# EAGLE schematic 24x16_RGB_Top (EAGLE 6.5.0)

## Sheet 1 of 2
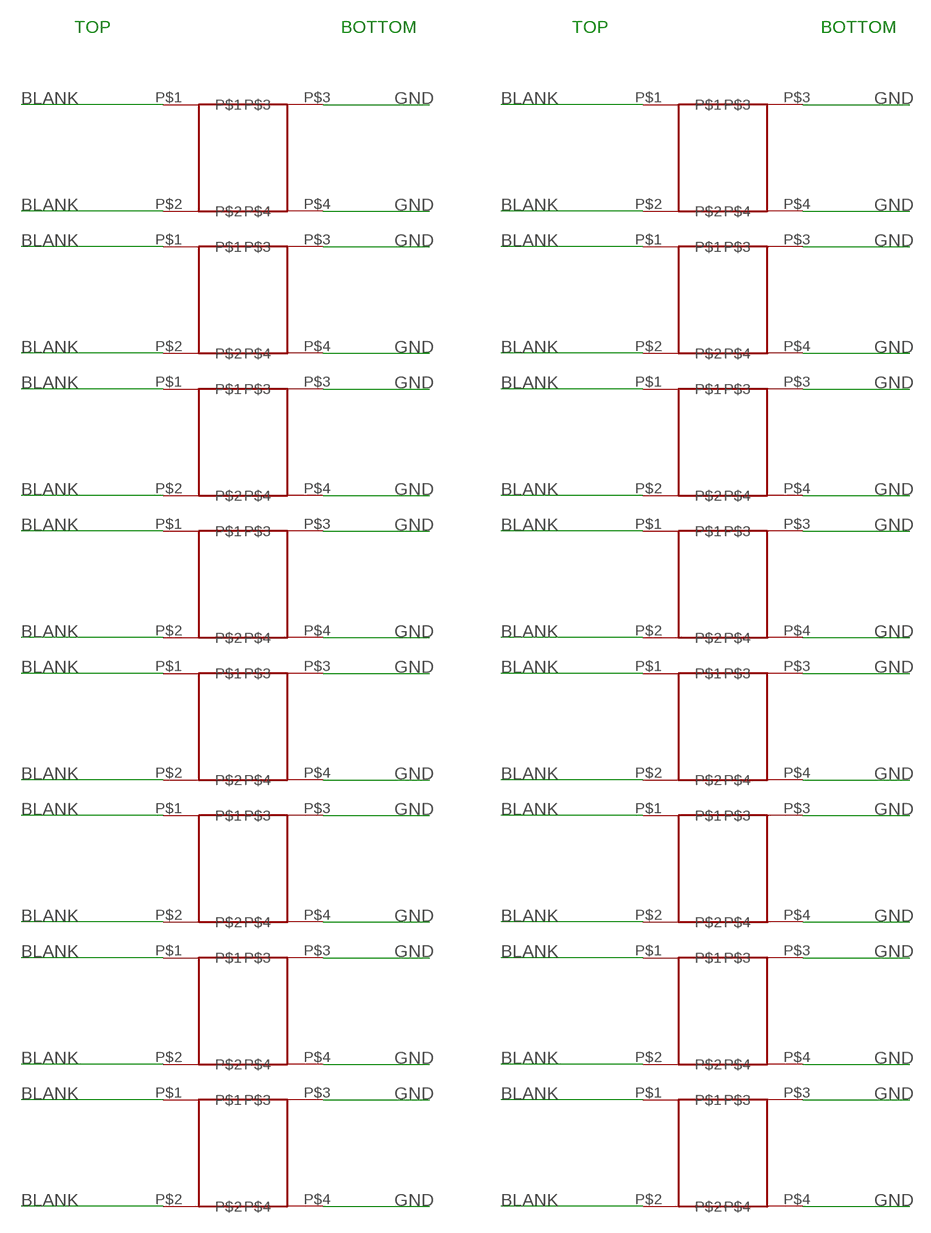
[diagram p0: schematic, sheet 1]

### Parts
SLOT1  SLOT  [SLOT]
SLOT2  SLOT  [SLOT]
SLOT3  SLOT  [SLOT]
SLOT4  SLOT  [SLOT]
SLOT5  SLOT  [SLOT]
SLOT6  SLOT  [SLOT]
SLOT7  SLOT  [SLOT]
SLOT8  SLOT  [SLOT]
SLOT9  SLOT  [SLOT]
SLOT10  SLOT  [SLOT]
SLOT11  SLOT  [SLOT]
SLOT12  SLOT  [SLOT]
SLOT13  SLOT  [SLOT]
SLOT14  SLOT  [SLOT]
SLOT15  SLOT  [SLOT]
SLOT16  SLOT  [SLOT]

### Nets
BLANK: SLOT1.P$1 SLOT1.P$2 SLOT2.P$1 SLOT2.P$2 SLOT3.P$1 SLOT3.P$2 SLOT4.P$1 SLOT4.P$2 SLOT5.P$1 SLOT5.P$2 SLOT6.P$1 SLOT6.P$2 SLOT7.P$1 SLOT7.P$2 SLOT8.P$1 SLOT8.P$2 SLOT9.P$1 SLOT9.P$2 SLOT10.P$1 SLOT10.P$2 SLOT11.P$1 SLOT11.P$2 SLOT12.P$1 SLOT12.P$2 SLOT13.P$1 SLOT13.P$2 SLOT14.P$1 SLOT14.P$2 SLOT15.P$1 SLOT15.P$2 SLOT16.P$1 SLOT16.P$2
GND: SLOT1.P$3 SLOT1.P$4 SLOT2.P$3 SLOT2.P$4 SLOT3.P$3 SLOT3.P$4 SLOT4.P$3 SLOT4.P$4 SLOT5.P$3 SLOT5.P$4 SLOT6.P$3 SLOT6.P$4 SLOT7.P$3 SLOT7.P$4 SLOT8.P$3 SLOT8.P$4 SLOT9.P$3 SLOT9.P$4 SLOT10.P$3 SLOT10.P$4 SLOT11.P$3 SLOT11.P$4 SLOT12.P$3 SLOT12.P$4 SLOT13.P$3 SLOT13.P$4 SLOT14.P$3 SLOT14.P$4 SLOT15.P$3 SLOT15.P$4 SLOT16.P$3 SLOT16.P$4 ; also sheet 2

### Notes on the sheet
- TOP | BOTTOM | TOP | BOTTOM

## Sheet 2 of 2
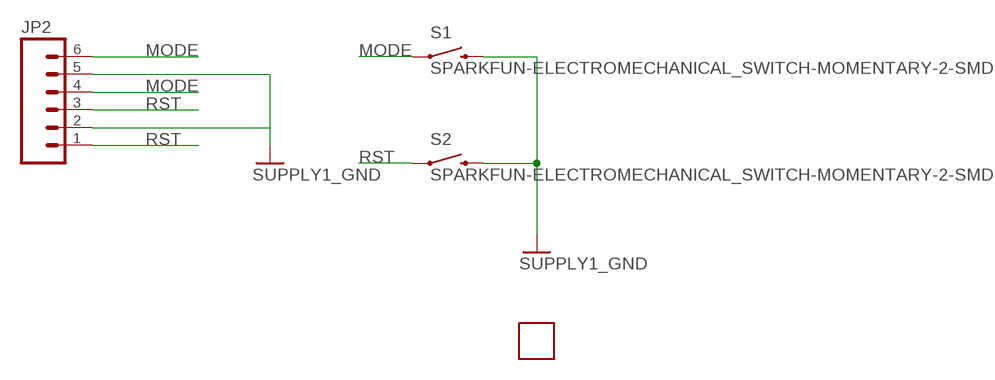
[diagram p1: schematic, sheet 2]

### Parts
JP2  M06SIP  [1X06]
S1  SPARKFUN-ELECTROMECHANICAL_SWITCH-MOMENTARY-2-SMD-1101NE  [SPARKFUN-ELECTROMECHANICAL_TACTILE-SWITCH-1101NE]
S2  SPARKFUN-ELECTROMECHANICAL_SWITCH-MOMENTARY-2-SMD-1101NE  [SPARKFUN-ELECTROMECHANICAL_TACTILE-SWITCH-1101NE]
U$1  USB_PANNEL  [USB_PANNEL]

### Nets
GND: JP2.2 JP2.5 S1.P$2 S2.P$2 ; supply symbol labelled SUPPLY1_GND ; also sheet 1
MODE: JP2.4 JP2.6 S1.P$1
RST: JP2.1 JP2.3 S2.P$1

## Library data of the parts
JP2 = SparkFun-Connectors:M06: Header 6 Standard 6-pin 0.1" header. Use with straight break away headers (SKU : PRT-00116), right angle break away headers (PRT-00553), swiss pins (PRT-00743), machine pins (PRT-00117), and female headers (PRT-00115). Molex polarized connector foot print use with SKU : PRT-08094 with associated crimp pins and housings. NOTES ON THE VARIANTS LOCK and LOCK_LONGPADS... This footprint was designed to help hold the alignment of a through-hole component (i.e. 6-pin header) while soldering it into place. You may notice that each hole has been shifted either up or down by 0.005 of an inch from it's more standard position (which is a perfectly straight line). This slight alteration caused the pins (the squares in the middle) to touch the edges of the holes. Because they are alternating, it causes a "brace" to hold the component in place. 0.005 has proven to be the perfect amount of "off-center" position when using our standard breakaway headers. Although looks a little odd when you look at the bare footprint, once you have a header in there, the alteration is very hard to notice. Also,if you push a header all the way into place, it is covered up entirely on the bottom side. This idea of altering the position of holes to aid alignment will be further integrated into the Sparkfun Library for other footprints. It can help hold any component with 3 or more connection pins.
S1 S2 = tvbgone-2layer:SPARKFUN-ELECTROMECHANICAL_SWITCH-MOMENTARY-2: Various NO switches- pushbuttons, reed, etc
SLOT1-SLOT16 = 24x16_RGB_Bottom:SLOT; OC_NEWARK: unknown
U$1 = 24x16_RGB_Bottom:USB_PANNEL